# EAGLE design TLE5010 (EAGLE 9.4.2)
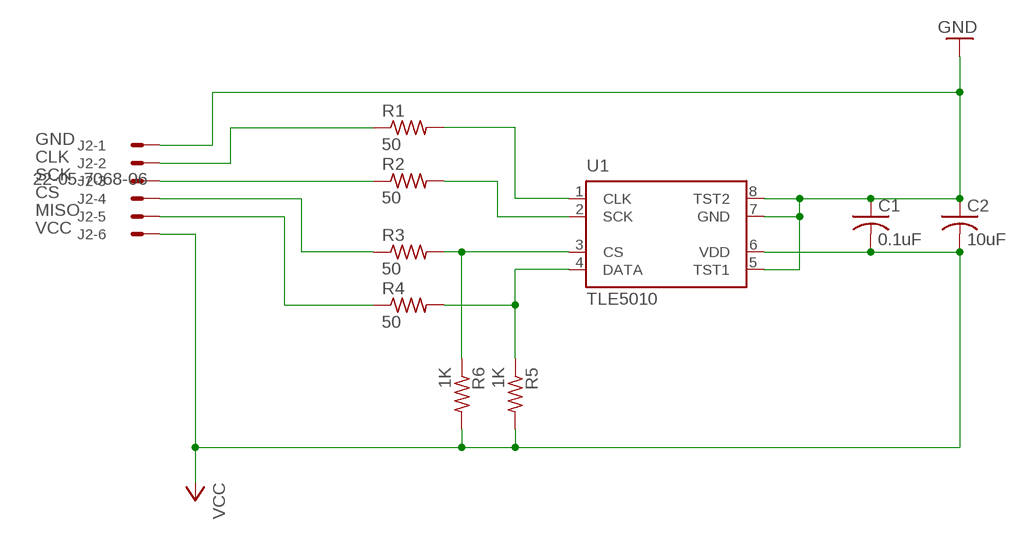
[diagram p0: schematic, sheet 1]

## Parts
C1  0.1uF  C-USC1206  [C1206]
C2  10uF  C-USC1206  [C1206]
J2  22-05-7068-06  [7395-06]
R1  50  R-US_R1206  [R1206]
R2  50  R-US_R1206  [R1206]
R3  50  R-US_R1206  [R1206]
R4  50  R-US_R1206  [R1206]
R5  1K  R-US_R1206  [R1206]
R6  1K  R-US_R1206  [R1206]
U1  TLE5010  [PG-DSO-8]

## Nets
CLK: J2.2 R1.1
CS: J2.4 R3.1
DATA: R4.2 R5.1 U1.4(DATA)
GND: C1.1 C2.1 J2.1 U1.5(TST1) U1.7(GND) U1.8(TST2)
MISO: J2.5 R4.1
N$1: R1.2 U1.1(CLK)
N$2: R2.2 U1.2(SCK)
N$3: R3.2 R6.1 U1.3(CS)
SCK: J2.3 R2.1
VCC: C1.2 C2.2 J2.6 R5.2 R6.2 U1.6(VDD)

## Library data of the parts
C1 C2 = resistor:C-US: CAPACITOR, American symbol
J2 = con-molex:22-?-06: CONNECTOR wire to board 2.54 mm (.1 inch) pitch header; MF: MOLEX; OC_FARNELL: unknown; OC_NEWARK: unknown
R1-R6 = resistor:R-US_: RESISTOR, American symbol
U1 = infineon:TLE5010: TLE5010 GMR Angular Sensor VDD 5.0V Angle Range 0–360

## Board
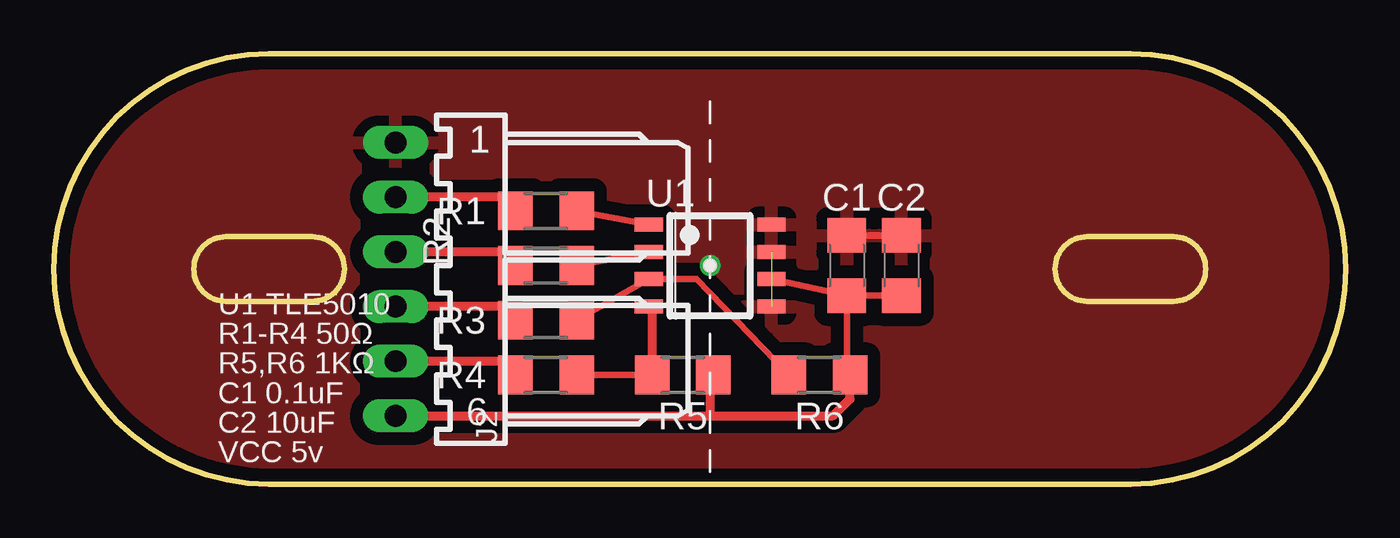
[diagram p1: board, top side]

Size 60 x 20 mm. Coordinates in mm from the lower left corner, seen from the top.
Outline: 10,20 arc180 10,0 50,0 arc180 50,20 10,20
Copper layers (1*16): Top 0.0356mm / dielectric 1.5011mm / Bottom 0.0356mm
Design rules "OSH Park 2layer *": minimum track width 6mil, minimum drill 13mil, track to track 6mil, track to pad 6mil, pad to pad 6mil, via to via 6mil, smd to smd 6mil, copper to edge 0.2mm, drill to drill 6mil, minimum pad ring 7mil, minimum via ring 7mil, stop-mask expansion 2.5mil, vias tented up to drill 0mil, thermal gap 20mil
Milling: 8 lines

### Footprints (pad centres in the part's own frame; a part is rotated, then mirrored left to right if it is on the bottom)
C1206 = smd 1.6 x 1.8: 1 -1.4,0; 2 1.4,0
7395-06 = drill 1.016 long: 1 6.35,0; 2 3.81,0; 3 1.27,0; 4 -1.27,0; 5 -3.81,0; 6 -6.35,0
R1206 = smd 1.6 x 1.803: 1 -1.422,0; 2 1.422,0
PG-DSO-8 = smd 0.65 x 1.31: 1 -1.905,-2.845; 2 -0.635,-2.845; 3 0.635,-2.845; 4 1.905,-2.845; 5 1.905,2.845; 6 0.635,2.845; 7 -0.635,2.845; 8 -1.905,2.845

### Placement (x,y rotation side)
C1  36.83,10.16 270 top
C2  39.37,10.16 270 top
J2  15.88,9.53 90 top
R1  22.86,12.7 0 top
R2  22.86,10.16 0 top
R3  22.86,7.62 0 top
R4  22.86,5.08 0 top
R5  29.21,5.08 0 top
R6  35.56,5.08 0 top
U1  30.48,10.16 270 top

### Tracks (layer width: path | path; a pad name or v marks a point on that pad's centre or on a via)
CLK
  Top 0.406: R1.1 20.8,13.34 J2.2
CS
  Top 0.406: R3.1 20.8,8.26 J2.4
DATA
  Top 0.305: R4.2 R5.1
  Top 0.406: U1.4 27.79,8.1 R5.1
GND  (via drill 0.6)  (1 unrouted)
  Top 0.152: 36.93,11.58 C1.1
  Top 0.305: 36.93,11.58 36.95,11.56 C2.1
  other vias: 30.48,10.16
  pour Top (isolate 0.6): 60.96,-1.27 -1.27,-1.27 -1.27,20.32 60.96,20.32
MISO
  Top 0.406: J2.5 20.8,5.71 R4.1
N$1
  Top 0.305: U1.1 | U1.1 R1.2
N$2
  Top 0.305: U1.2 | U1.2 R2.2
N$3
  Top 0.305: R3.2 U1.3 29.84,9.53 30.48,8.89 R6.1
SCK
  Top 0.406: R2.1 20.8,10.79 J2.3
VCC
  Top 0.305: R6.2 36.83,5.23 C1.2 | C1.2 C2.2 | C1.2 U1.6 | R5.2 30.48,5.08
  Top 0.406: 30.48,3.17 36.2,3.17 36.98,3.96 R6.2 | R5.2 30.48,4.93 30.48,3.17 | J2.6 30.48,3.17

### Text on the board
tNames: U1 TLE5010 / R1-R4 50Ω / R5,R6 1KΩ / C1 0.1uF / C2 10uF / VCC 5v
bNames: Gnd | CLK | SCK | CS | MISO | Vcc